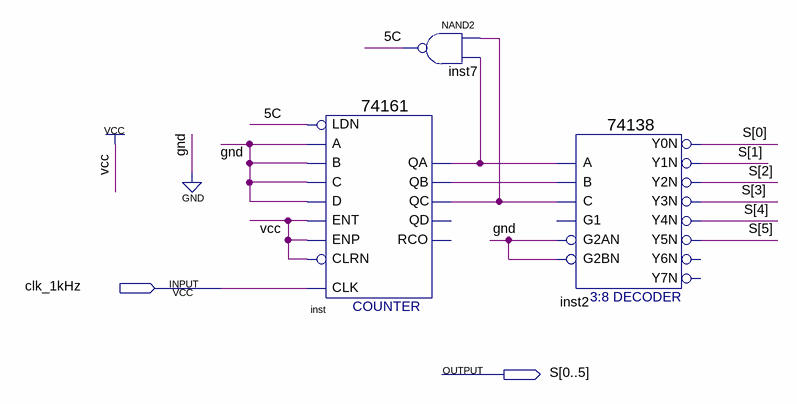
[diagram p0: schematic sheet]
// Quartus schematic switch.bdf as structural Verilog: 3 symbols, 2 pins
module switch (
  input  clk_1kHz,
  output [0:5] S
);

  wire \5C , inst_qa, inst_qb, inst_qc;

  \74161  inst (
    .CLRN(1'b1), .CLK(clk_1kHz), .ENP(1'b1), .LDN(\5C ), .A(1'b0), .D(1'b0), .ENT(1'b1), .B(1'b0), .C(1'b0),
    .QC(inst_qc), .QB(inst_qb), .QA(inst_qa));  // open: QD, RCO
  nand inst7 (\5C , inst_qc, inst_qa);
  \74138  inst2 (
    .A(inst_qa), .B(inst_qb), .C(inst_qc), .G2AN(1'b0), .G2BN(1'b0), .Y0N(S[0]), .Y1N(S[1]), .Y2N(S[2]),
    .Y3N(S[3]), .Y4N(S[4]), .Y5N(S[5]));  // open: G1, Y6N, Y7N
endmodule
